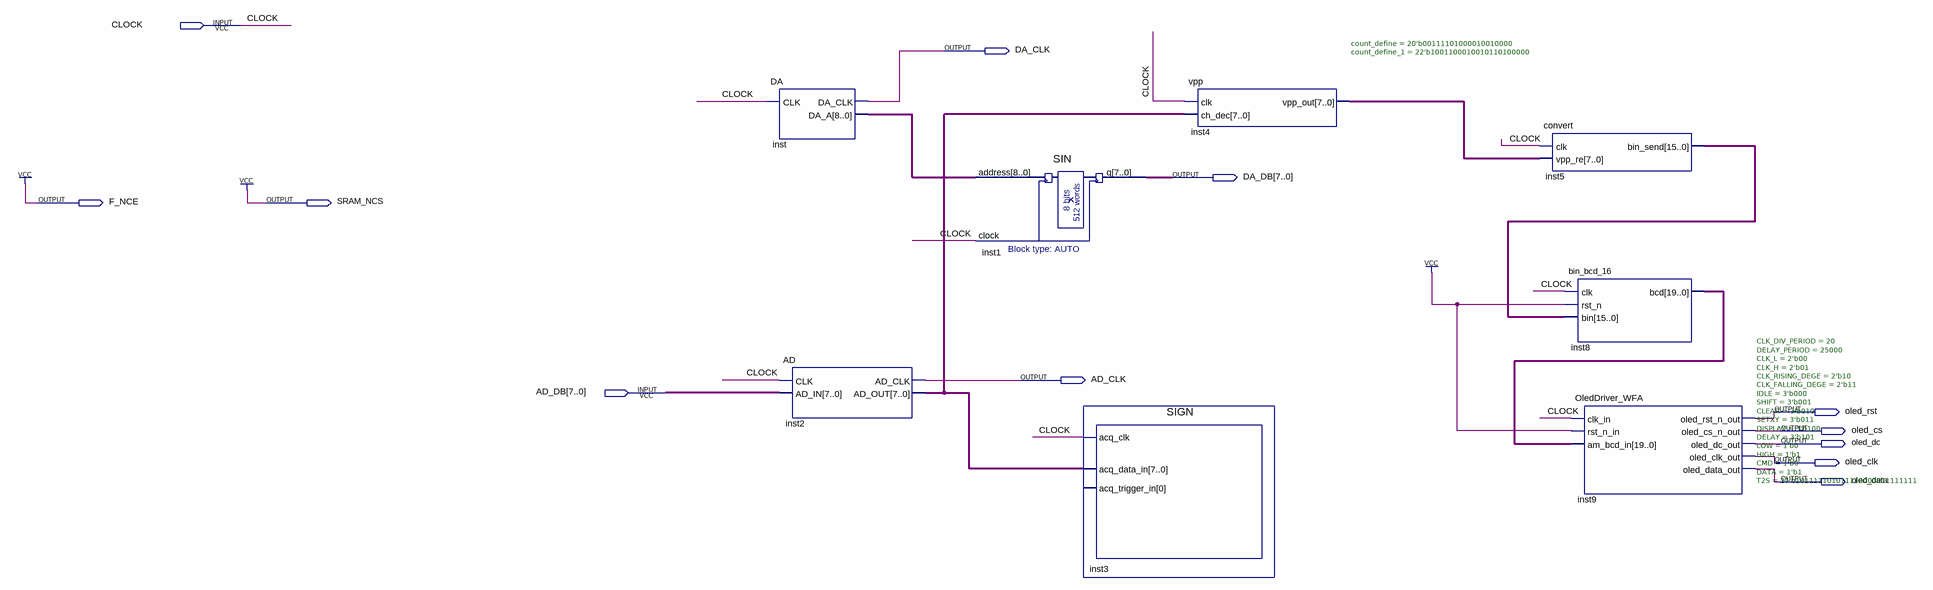
[diagram p0: schematic sheet]
// Quartus schematic ADDA.bdf as structural Verilog: 8 symbols, 12 pins
module ADDA (
  input  CLOCK,
  input  [7:0] AD_DB,
  output DA_CLK,
  output [7:0] DA_DB,
  output F_NCE,
  output SRAM_NCS,
  output AD_CLK,
  output oled_rst,
  output oled_cs,
  output oled_dc,
  output oled_clk,
  output oled_data
);

  wire [7:0] inst2_ad_out, inst4_vpp_out;
  wire [8:0] inst_da_a;
  wire [15:0] inst5_bin_send;
  wire [19:0] inst8_bcd;

  DA inst (.CLK(CLOCK), .DA_CLK(DA_CLK), .DA_A(inst_da_a));
  AD inst2 (.CLK(CLOCK), .AD_IN(AD_DB), .AD_CLK(AD_CLK), .AD_OUT(inst2_ad_out));
  SIN inst1 (.address(inst_da_a), .clock(CLOCK), .q(DA_DB));
  SIGN inst3 (.acq_clk(CLOCK), .acq_data_in(inst2_ad_out));  // open: acq_trigger_in
  vpp #(.count_define(20'b00111101000010010000), .count_define_1(22'b1001100010010110100000)) inst4 (
    .clk(CLOCK), .ch_dec(inst2_ad_out), .vpp_out(inst4_vpp_out));
  convert inst5 (.clk(CLOCK), .vpp_re(inst4_vpp_out), .bin_send(inst5_bin_send));
  bin_bcd_16 inst8 (.clk(CLOCK), .rst_n(1'b1), .bin(inst5_bin_send), .bcd(inst8_bcd));
  OledDriver_WFA #(.CLK_DIV_PERIOD(20), .DELAY_PERIOD(25000), .CLK_L(2'b00), .CLK_H(2'b01), .CLK_RISING_DEGE(2'b10), .CLK_FALLING_DEGE(2'b11), .IDLE(3'b000), .SHIFT(3'b001), .CLEAR(3'b010), .SETXY(3'b011), .DISPLAY(3'b100), .DELAY(3'b101), .LOW(1'b0), .HIGH(1'b1), .CMD(1'b0), .DATA(1'b1), .T2S(27'b101111101011110000011111111)) inst9 (
    .clk_in(CLOCK), .rst_n_in(1'b1), .am_bcd_in(inst8_bcd), .oled_rst_n_out(oled_rst),
    .oled_cs_n_out(oled_cs), .oled_dc_out(oled_dc), .oled_clk_out(oled_clk), .oled_data_out(oled_data));

  assign F_NCE = 1'b1;
  assign SRAM_NCS = 1'b1;
endmodule
